# Altium schematic sheet RTD board, study for daisy chain.SchDoc
size D; PageSetup: Record=PageOptions|CenterHorizontal=True|CenterVertical=True|PrintScale=0.51|XCorrection=1.00|YCorrection=1.00|PrintKind=0|BorderSize=5000000|LeftOffset=0|BottomOffset=0|Orientation=2|PaperLength=1000|PaperWidth=1000|Scale=100|PaperSource=7|PrintQuality=-4|MediaType=1|DitherType=10|PaperKind=Tabloid|PrintScaleMode=1
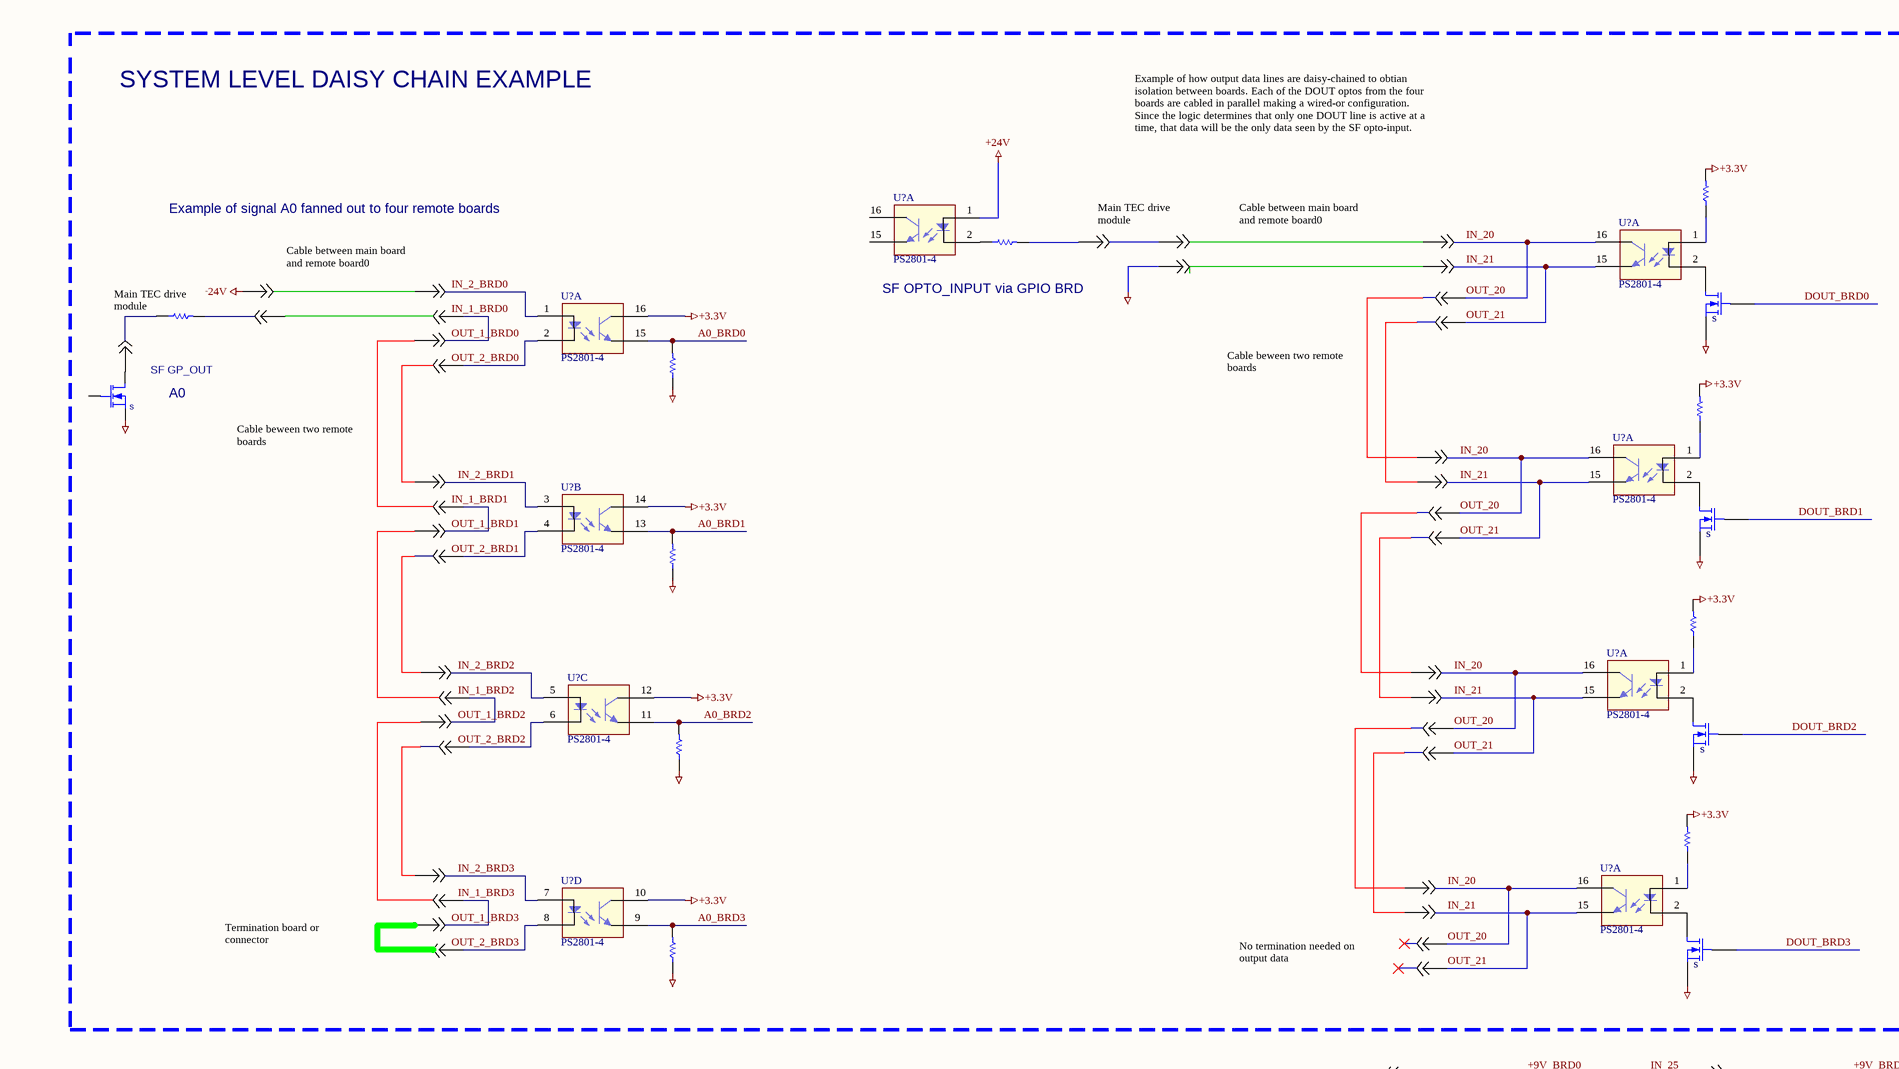
[diagram p0: RTD board, study for daisy chain.SchDoc, top left]
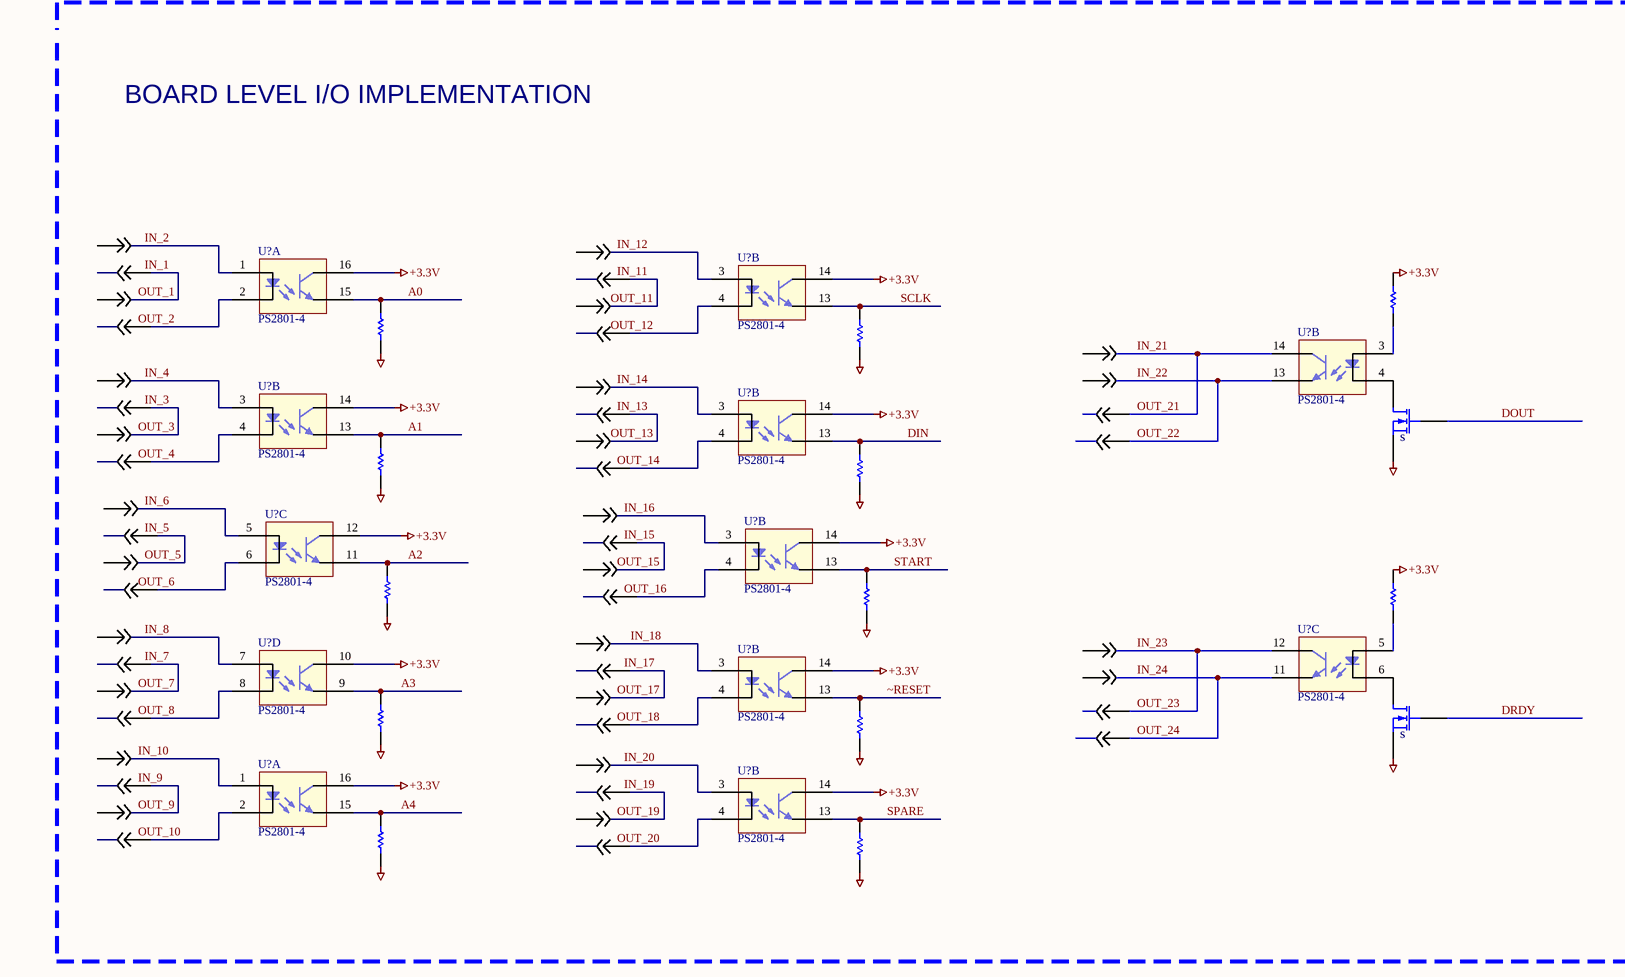
[diagram p1: RTD board, study for daisy chain.SchDoc, top right]
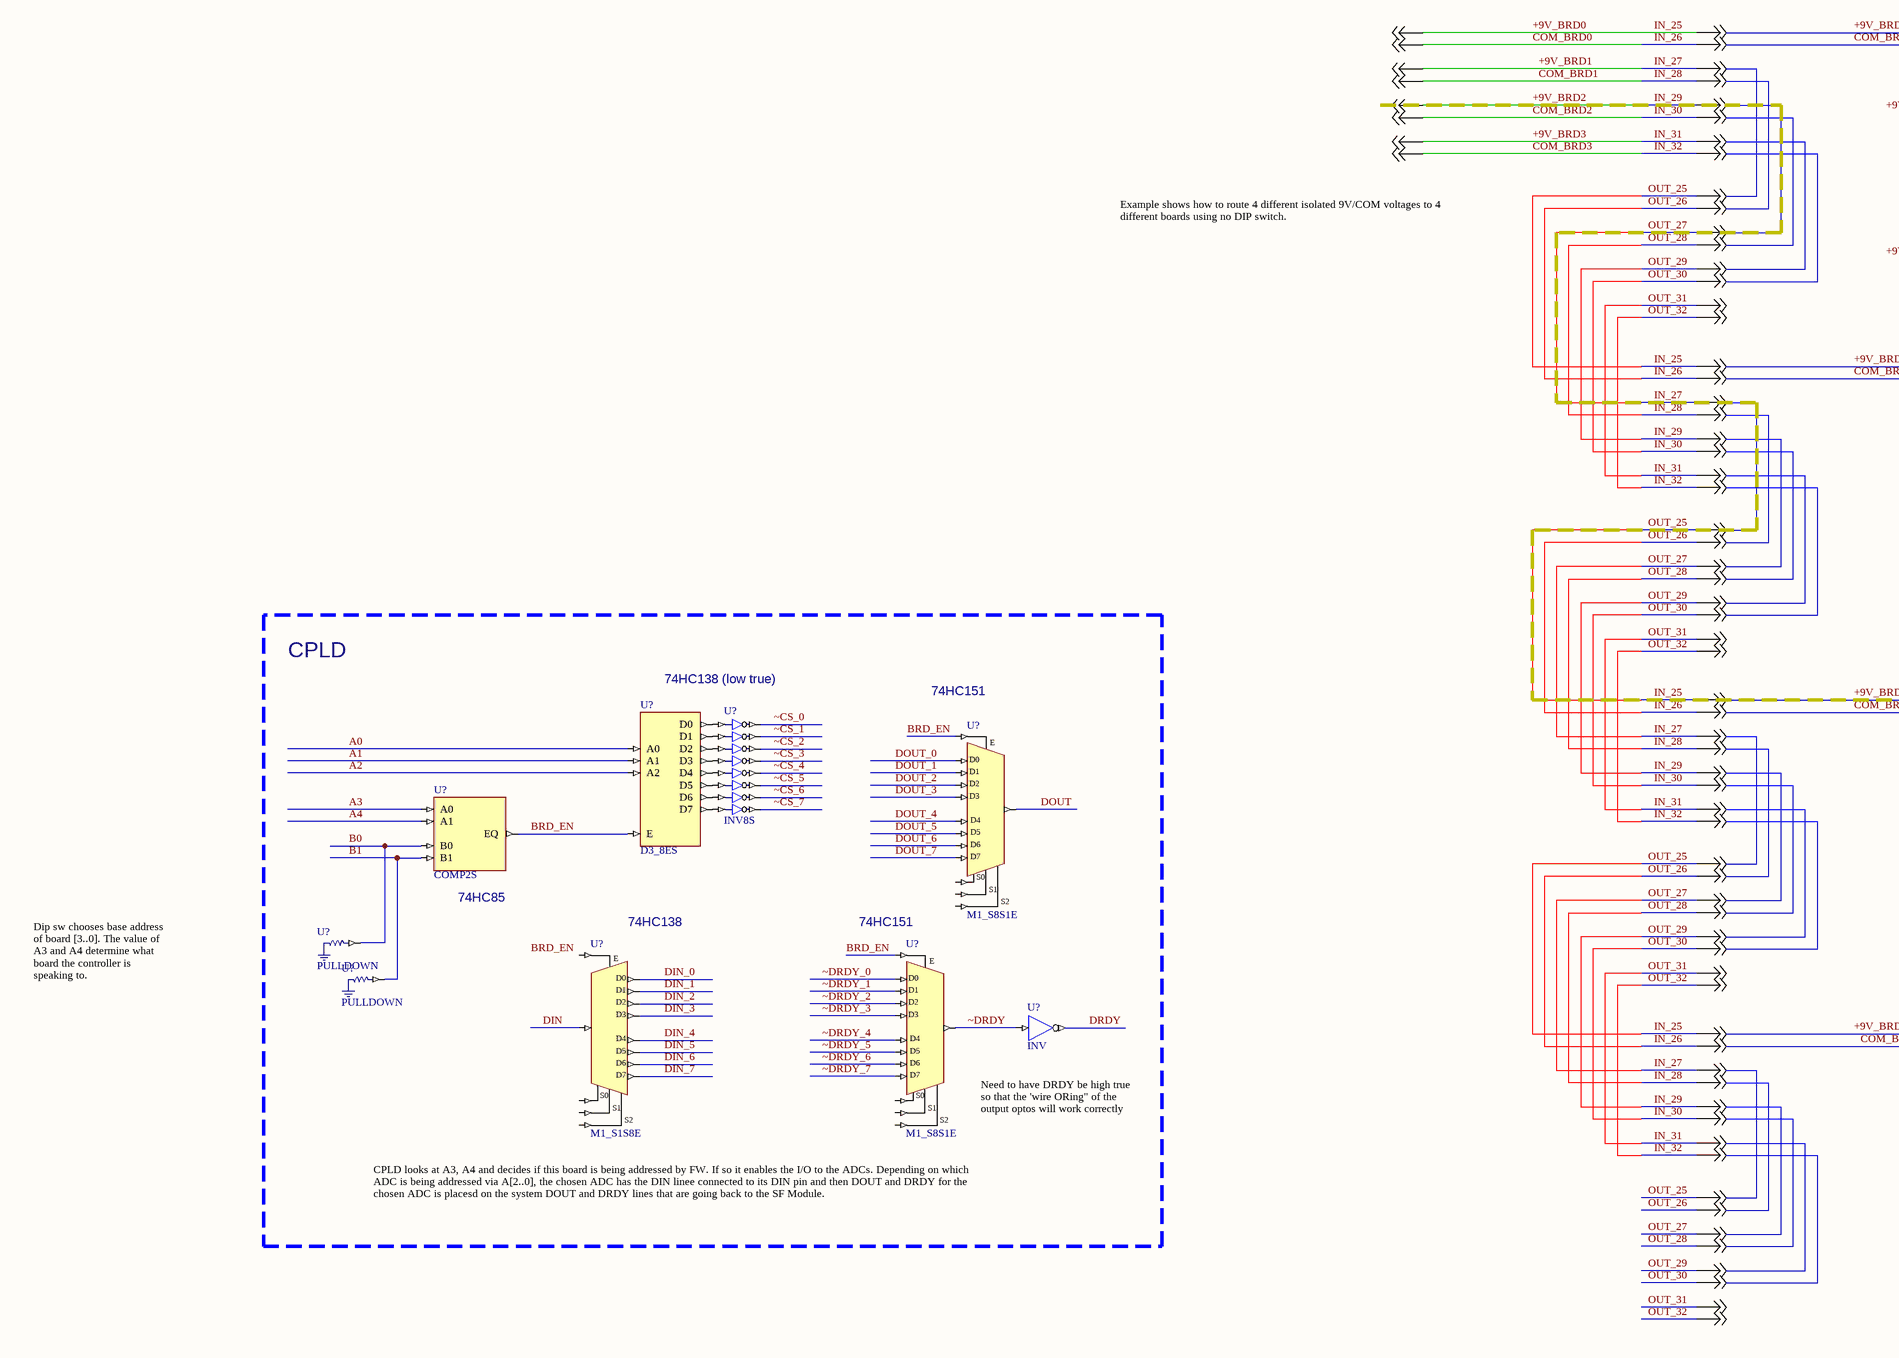
[diagram p2: RTD board, study for daisy chain.SchDoc, bottom left]
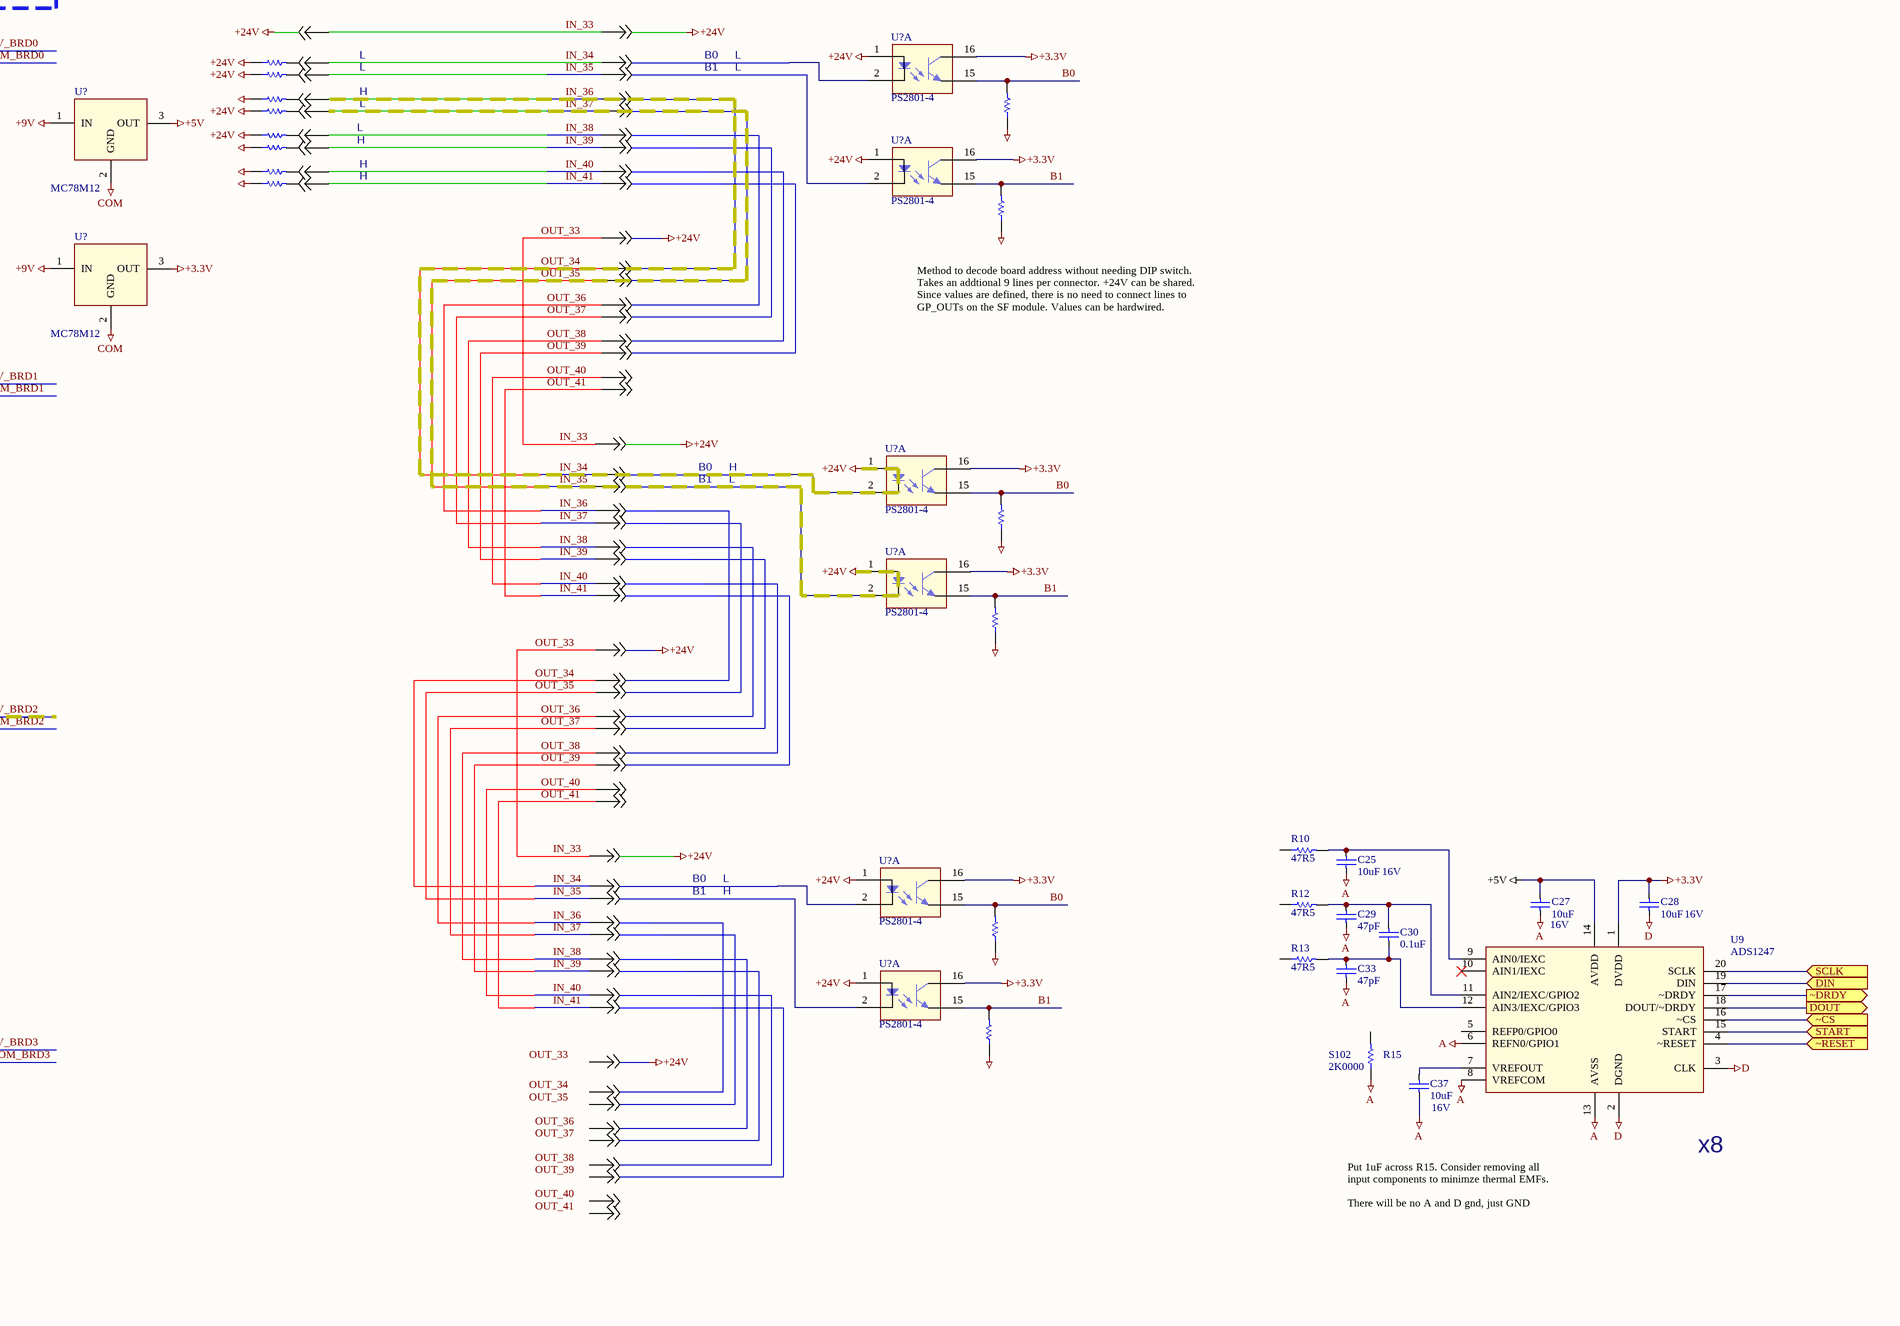
[diagram p3: RTD board, study for daisy chain.SchDoc, bottom right]

## Parts
(Parts that share a designator on the sheet are numbered #1, #2 ... from top to bottom, then left to right.)
C25  16V  value 10uF  [SMD_0805]
C27  16V  value 10uF  [SMD_0805]
C28  16V  value 10uF  [SMD_0805]
C29  value 47pF  [SMD_0805]  (hidden comment: Cap SMD)
C30  value 0.1uF  [SMD_0805]  (hidden comment: Cap SMD)
C33  value 47pF  [SMD_0805]  (hidden comment: Cap SMD)
C37  16V  value 10uF  [SMD_0805]
J?#1  Conn Feedthru  [Conn feed thru]  (value not drawn)
J?#2  Conn Feedthru  [Conn feed thru]  (value not drawn)
J?#3  Conn Feedthru  [Conn feed thru]  (value not drawn)
J?#4  Conn Feedthru  [Conn feed thru]  (value not drawn)
J?#5  Conn Feedthru  [Conn feed thru]  (value not drawn)
J?#6  Conn Feedthru  [Conn feed thru]  (value not drawn)
J?#7  Conn Feedthru  [Conn feed thru]  (value not drawn)
J?#8  Conn Feedthru  [Conn feed thru]  (value not drawn)
J?#9  Conn Feedthru  [Conn feed thru]  (value not drawn)
J?#10  Conn Feedthru  [Conn feed thru]  (value not drawn)
J?#11  Conn Feedthru  [Conn feed thru]  (value not drawn)
J?#12  Conn Feedthru  [Conn feed thru]  (value not drawn)
J?#13  Conn Feedthru  [Conn feed thru]  (value not drawn)
J?#14  Conn Feedthru  [Conn feed thru]  (value not drawn)
J?#15  Conn Feedthru  [Conn feed thru]  (value not drawn)
J?#16  Conn Feedthru  [Conn feed thru]  (value not drawn)
J?#17  Conn Feedthru  [Conn feed thru]  (value not drawn)
J?#18  Conn Feedthru  [Conn feed thru]  (value not drawn)
J?#19  Conn Feedthru  [Conn feed thru]  (value not drawn)
J?#20  Conn Feedthru  [Conn feed thru]  (value not drawn)
J?#21  Conn Feedthru  [Conn feed thru]  (value not drawn)
J?#22  Conn Feedthru  [Conn feed thru]  (value not drawn)
J?#23  Conn Feedthru  [Conn feed thru]  (value not drawn)
J?#24  Conn Feedthru  [Conn feed thru]  (value not drawn)
J?#25  Conn Feedthru  [Conn feed thru]  (value not drawn)
J?#26  Conn Feedthru  [Conn feed thru]  (value not drawn)
J?#27  Conn Feedthru  [Conn feed thru]  (value not drawn)
J?#28  Conn Feedthru  [Conn feed thru]  (value not drawn)
J?#29  Conn Feedthru  [Conn feed thru]  (value not drawn)
J?#30  Conn Feedthru  [Conn feed thru]  (value not drawn)
J?#31  Conn Feedthru  [Conn feed thru]  (value not drawn)
J?#32  Conn Feedthru  [Conn feed thru]  (value not drawn)
J?#33  Conn Feedthru  [Conn feed thru]  (value not drawn)
J?#34  Conn Feedthru  [Conn feed thru]  (value not drawn)
J?#35  Conn Feedthru  [Conn feed thru]  (value not drawn)
J?#36  Conn Feedthru  [Conn feed thru]  (value not drawn)
J?#37  Conn Feedthru  [Conn feed thru]  (value not drawn)
J?#38  Conn Feedthru  [Conn feed thru]  (value not drawn)
J?#39  Conn Feedthru  [Conn feed thru]  (value not drawn)
J?#40  Conn Feedthru  [Conn feed thru]  (value not drawn)
J?#41  Conn Feedthru  [Conn feed thru]  (value not drawn)
J?#42  Conn Feedthru  [Conn feed thru]  (value not drawn)
J?#43  Conn Feedthru  [Conn feed thru]  (value not drawn)
J?#44  Conn Feedthru  [Conn feed thru]  (value not drawn)
J?#45  Conn Feedthru  [Conn feed thru]  (value not drawn)
J?#46  Conn Feedthru  [Conn feed thru]  (value not drawn)
J?#47  Conn Feedthru  [Conn feed thru]  (value not drawn)
J?#48  Conn Feedthru  [Conn feed thru]  (value not drawn)
J?#49  Conn Feedthru  [Conn feed thru]  (value not drawn)
J?#50  Conn Feedthru  [Conn feed thru]  (value not drawn)
J?#51  Conn Feedthru  [Conn feed thru]  (value not drawn)
J?#52  Conn Feedthru  [Conn feed thru]  (value not drawn)
J?#53  Conn Feedthru  [Conn feed thru]  (value not drawn)
J?#54  Conn Feedthru  [Conn feed thru]  (value not drawn)
J?#55  Conn Feedthru  [Conn feed thru]  (value not drawn)
J?#56  Conn Feedthru  [Conn feed thru]  (value not drawn)
J?#57  Conn Feedthru  [Conn feed thru]  (value not drawn)
J?#58  Conn Feedthru  [Conn feed thru]  (value not drawn)
J?#59  Conn Feedthru  [Conn feed thru]  (value not drawn)
J?#60  Conn Feedthru  [Conn feed thru]  (value not drawn)
J?#61  Conn Feedthru  [Conn feed thru]  (value not drawn)
J?#62  Conn Feedthru  [Conn feed thru]  (value not drawn)
J?#63  Conn Feedthru  [Conn feed thru]  (value not drawn)
J?#64  Conn Feedthru  [Conn feed thru]  (value not drawn)
J?#65  Conn Feedthru  [Conn feed thru]  (value not drawn)
J?#66  Conn Feedthru  [Conn feed thru]  (value not drawn)
J?#67  Conn Feedthru  [Conn feed thru]  (value not drawn)
J?#68  Conn Feedthru  [Conn feed thru]  (value not drawn)
J?#69  Conn Feedthru  [Conn feed thru]  (value not drawn)
J?#70  Conn Feedthru  [Conn feed thru]  (value not drawn)
J?#71  Conn Feedthru  [Conn feed thru]  (value not drawn)
J?#72  Conn Feedthru  [Conn feed thru]  (value not drawn)
J?#73  Conn Feedthru  [Conn feed thru]  (value not drawn)
J?#74  Conn Feedthru  [Conn feed thru]  (value not drawn)
J?#75  Conn Feedthru  [Conn feed thru]  (value not drawn)
J?#76  Conn Feedthru  [Conn feed thru]  (value not drawn)
J?#77  Conn Feedthru  [Conn feed thru]  (value not drawn)
J?#78  Conn Feedthru  [Conn feed thru]  (value not drawn)
J?#79  Conn Feedthru  [Conn feed thru]  (value not drawn)
J?#80  Conn Feedthru  [Conn feed thru]  (value not drawn)
J?#81  Conn Feedthru  [Conn feed thru]  (value not drawn)
J?#82  Conn Feedthru  [Conn feed thru]  (value not drawn)
J?#83  Conn Feedthru  [Conn feed thru]  (value not drawn)
J?#84  Conn Feedthru  [Conn feed thru]  (value not drawn)
J?#85  Conn Feedthru  [Conn feed thru]  (value not drawn)
J?#86  Conn Feedthru  [Conn feed thru]  (value not drawn)
J?#87  Conn Feedthru  [Conn feed thru]  (value not drawn)
J?#88  Conn Feedthru  [Conn feed thru]  (value not drawn)
J?#89  Conn Feedthru  [Conn feed thru]  (value not drawn)
J?#90  Conn Feedthru  [Conn feed thru]  (value not drawn)
J?#91  Conn Feedthru  [Conn feed thru]  (value not drawn)
J?#92  Conn Feedthru  [Conn feed thru]  (value not drawn)
J?#93  Conn Feedthru  [Conn feed thru]  (value not drawn)
J?#94  Conn Feedthru  [Conn feed thru]  (value not drawn)
J?#95  Conn Feedthru  [Conn feed thru]  (value not drawn)
J?#96  Conn Feedthru  [Conn feed thru]  (value not drawn)
J?#97  Conn Feedthru  [Conn feed thru]  (value not drawn)
J?#98  Conn Feedthru  [Conn feed thru]  (value not drawn)
J?#99  Conn Feedthru  [Conn feed thru]  (value not drawn)
J?#100  Conn Feedthru  [Conn feed thru]  (value not drawn)
J?#101  Conn Feedthru  [Conn feed thru]  (value not drawn)
J?#102  Conn Feedthru  [Conn feed thru]  (value not drawn)
J?#103  Conn Feedthru  [Conn feed thru]  (value not drawn)
J?#104  Conn Feedthru  [Conn feed thru]  (value not drawn)
J?#105  Conn Feedthru  [Conn feed thru]  (value not drawn)
J?#106  Conn Feedthru  [Conn feed thru]  (value not drawn)
J?#107  Conn Feedthru  [Conn feed thru]  (value not drawn)
J?#108  Conn Feedthru  [Conn feed thru]  (value not drawn)
J?#109  Conn Feedthru  [Conn feed thru]  (value not drawn)
J?#110  Conn Feedthru  [Conn feed thru]  (value not drawn)
J?#111  Conn Feedthru  [Conn feed thru]  (value not drawn)
J?#112  Conn Feedthru  [Conn feed thru]  (value not drawn)
J?#113  Conn Feedthru  [Conn feed thru]  (value not drawn)
J?#114  Conn Feedthru  [Conn feed thru]  (value not drawn)
J?#115  Conn Feedthru  [Conn feed thru]  (value not drawn)
J?#116  Conn Feedthru  [Conn feed thru]  (value not drawn)
J?#117  Conn Feedthru  [Conn feed thru]  (value not drawn)
J?#118  Conn Feedthru  [Conn feed thru]  (value not drawn)
J?#119  Conn Feedthru  [Conn feed thru]  (value not drawn)
J?#120  Conn Feedthru  [Conn feed thru]  (value not drawn)
J?#121  Conn Feedthru  [Conn feed thru]  (value not drawn)
J?#122  Conn Feedthru  [Conn feed thru]  (value not drawn)
J?#123  Conn Feedthru  [Conn feed thru]  (value not drawn)
J?#124  Conn Feedthru  [Conn feed thru]  (value not drawn)
J?#125  Conn Feedthru  [Conn feed thru]  (value not drawn)
J?#126  Conn Feedthru  [Conn feed thru]  (value not drawn)
J?#127  Conn Feedthru  [Conn feed thru]  (value not drawn)
J?#128  Conn Feedthru  [Conn feed thru]  (value not drawn)
J?#129  Conn Feedthru  [Conn feed thru]  (value not drawn)
J?#130  Conn Feedthru  [Conn feed thru]  (value not drawn)
J?#131  Conn Feedthru  [Conn feed thru]  (value not drawn)
J?#132  Conn Feedthru  [Conn feed thru]  (value not drawn)
J?#133  Conn Feedthru  [Conn feed thru]  (value not drawn)
J?#134  Conn Feedthru  [Conn feed thru]  (value not drawn)
J?#135  Conn Feedthru  [Conn feed thru]  (value not drawn)
J?#136  Conn Feedthru  [Conn feed thru]  (value not drawn)
J?#137  Conn Feedthru  [Conn feed thru]  (value not drawn)
J?#138  Conn Feedthru  [Conn feed thru]  (value not drawn)
J?#139  Conn Feedthru  [Conn feed thru]  (value not drawn)
J?#140  Conn Feedthru  [Conn feed thru]  (value not drawn)
J?#141  Conn Feedthru  [Conn feed thru]  (value not drawn)
J?#142  Conn Feedthru  [Conn feed thru]  (value not drawn)
J?#143  Conn Feedthru  [Conn feed thru]  (value not drawn)
J?#144  Conn Feedthru  [Conn feed thru]  (value not drawn)
J?#145  Conn Feedthru  [Conn feed thru]  (value not drawn)
J?#146  Conn Feedthru  [Conn feed thru]  (value not drawn)
J?#147  Conn Feedthru  [Conn feed thru]  (value not drawn)
J?#148  Conn Feedthru  [Conn feed thru]  (value not drawn)
J?#149  Conn Feedthru  [Conn feed thru]  (value not drawn)
J?#150  Conn Feedthru  [Conn feed thru]  (value not drawn)
J?#151  Conn Feedthru  [Conn feed thru]  (value not drawn)
J?#152  Conn Feedthru  [Conn feed thru]  (value not drawn)
J?#153  Conn Feedthru  [Conn feed thru]  (value not drawn)
J?#154  Conn Feedthru  [Conn feed thru]  (value not drawn)
J?#155  Conn Feedthru  [Conn feed thru]  (value not drawn)
J?#156  Conn Feedthru  [Conn feed thru]  (value not drawn)
J?#157  Conn Feedthru  [Conn feed thru]  (value not drawn)
J?#158  Conn Feedthru  [Conn feed thru]  (value not drawn)
J?#159  Conn Feedthru  [Conn feed thru]  (value not drawn)
J?#160  Conn Feedthru  [Conn feed thru]  (value not drawn)
J?#161  Conn Feedthru  [Conn feed thru]  (value not drawn)
J?#162  Conn Feedthru  [Conn feed thru]  (value not drawn)
J?#163  Conn Feedthru  [Conn feed thru]  (value not drawn)
J?#164  Conn Feedthru  [Conn feed thru]  (value not drawn)
J?#165  Conn Feedthru  [Conn feed thru]  (value not drawn)
J?#166  Conn Feedthru  [Conn feed thru]  (value not drawn)
J?#167  Conn Feedthru  [Conn feed thru]  (value not drawn)
J?#168  Conn Feedthru  [Conn feed thru]  (value not drawn)
J?#169  Conn Feedthru  [Conn feed thru]  (value not drawn)
J?#170  Conn Feedthru  [Conn feed thru]  (value not drawn)
J?#171  Conn Feedthru  [Conn feed thru]  (value not drawn)
J?#172  Conn Feedthru  [Conn feed thru]  (value not drawn)
J?#173  Conn Feedthru  [Conn feed thru]  (value not drawn)
J?#174  Conn Feedthru  [Conn feed thru]  (value not drawn)
J?#175  Conn Feedthru  [Conn feed thru]  (value not drawn)
J?#176  Conn Feedthru  [Conn feed thru]  (value not drawn)
J?#177  Conn Feedthru  [Conn feed thru]  (value not drawn)
J?#178  Conn Feedthru  [Conn feed thru]  (value not drawn)
J?#179  Conn Feedthru  [Conn feed thru]  (value not drawn)
J?#180  Conn Feedthru  [Conn feed thru]  (value not drawn)
J?#181  Conn Feedthru  [Conn feed thru]  (value not drawn)
J?#182  Conn Feedthru  [Conn feed thru]  (value not drawn)
J?#183  Conn Feedthru  [Conn feed thru]  (value not drawn)
J?#184  Conn Feedthru  [Conn feed thru]  (value not drawn)
J?#185  Conn Feedthru  [Conn feed thru]  (value not drawn)
J?#186  Conn Feedthru  [Conn feed thru]  (value not drawn)
J?#187  Conn Feedthru  [Conn feed thru]  (value not drawn)
J?#188  Conn Feedthru  [Conn feed thru]  (value not drawn)
J?#189  Conn Feedthru  [Conn feed thru]  (value not drawn)
J?#190  Conn Feedthru  [Conn feed thru]  (value not drawn)
J?#191  Conn Feedthru  [Conn feed thru]  (value not drawn)
J?#192  Conn Feedthru  [Conn feed thru]  (value not drawn)
J?#193  Conn Feedthru  [Conn feed thru]  (value not drawn)
J?#194  Conn Feedthru  [Conn feed thru]  (value not drawn)
J?#195  Conn Feedthru  [Conn feed thru]  (value not drawn)
J?#196  Conn Feedthru  [Conn feed thru]  (value not drawn)
J?#197  Conn Feedthru  [Conn feed thru]  (value not drawn)
J?#198  Conn Feedthru  [Conn feed thru]  (value not drawn)
J?#199  Conn Feedthru  [Conn feed thru]  (value not drawn)
J?#200  Conn Feedthru  [Conn feed thru]  (value not drawn)
J?#201  Conn Feedthru  [Conn feed thru]  (value not drawn)
J?#202  Conn Feedthru  [Conn feed thru]  (value not drawn)
J?#203  Conn Feedthru  [Conn feed thru]  (value not drawn)
J?#204  Conn Feedthru  [Conn feed thru]  (value not drawn)
J?#205  Conn Feedthru  [Conn feed thru]  (value not drawn)
J?#206  Conn Feedthru  [Conn feed thru]  (value not drawn)
J?#207  Conn Feedthru  [Conn feed thru]  (value not drawn)
J?#208  Conn Feedthru  [Conn feed thru]  (value not drawn)
J?#209  Conn Feedthru  [Conn feed thru]  (value not drawn)
J?#210  Conn Feedthru  [Conn feed thru]  (value not drawn)
J?#211  Conn Feedthru  [Conn feed thru]  (value not drawn)
J?#212  Conn Feedthru  [Conn feed thru]  (value not drawn)
J?#213  Conn Feedthru  [Conn feed thru]  (value not drawn)
J?#214  Conn Feedthru  [Conn feed thru]  (value not drawn)
J?#215  Conn Feedthru  [Conn feed thru]  (value not drawn)
J?#216  Conn Feedthru  [Conn feed thru]  (value not drawn)
J?#217  Conn Feedthru  [Conn feed thru]  (value not drawn)
J?#218  Conn Feedthru  [Conn feed thru]  (value not drawn)
J?#219  Conn Feedthru  [Conn feed thru]  (value not drawn)
J?#220  Conn Feedthru  [Conn feed thru]  (value not drawn)
J?#221  Conn Feedthru  [Conn feed thru]  (value not drawn)
Q?#1  MOSFET-N SOT23  [SMD_SOT23_3]  (value not drawn)
Q?#2  STD30NF03L  [TO-252(D-PAK)  PowerPAD]  (value not drawn)
Q?#3  MOSFET-N SOT23  [SMD_SOT23_3]  (value not drawn)
Q?#4  MOSFET-N SOT23  [SMD_SOT23_3]  (value not drawn)
Q?#5  MOSFET-N SOT23  [SMD_SOT23_3]  (value not drawn)
Q?#6  MOSFET-N SOT23  [SMD_SOT23_3]  (value not drawn)
Q?#7  MOSFET-N SOT23  [SMD_SOT23_3]  (value not drawn)
R10  value 47R5  [SMD_0805]  (hidden comment: Res 0805)
R12  value 47R5  [SMD_0805]  (hidden comment: Res 0805)
R13  value 47R5  [SMD_0805]  (hidden comment: Res 0805)
R15  S102  value 2K0000  [Vishay S102 series]
R?#1  Res 0805  [smd_0805]  (value not drawn)
R?#2  Res 0805  [smd_0805]  (value not drawn)
R?#3  Res 0805  [smd_0805]  (value not drawn)
R?#4  Res 0805  [smd_0805]  (value not drawn)
R?#5  Res 0805  [smd_0805]  (value not drawn)
R?#6  Res 0805  [smd_0805]  (value not drawn)
R?#7  Res 0805  [smd_0805]  (value not drawn)
R?#8  Res 0805  [smd_0805]  (value not drawn)
R?#9  Res 0805  [smd_0805]  (value not drawn)
R?#10  Res 0805  [smd_0805]  (value not drawn)
R?#11  Res 0805  [smd_0805]  (value not drawn)
R?#12  Res 0805  [smd_0805]  (value not drawn)
R?#13  Res 0805  [smd_0805]  (value not drawn)
R?#14  Res 0805  [smd_0805]  (value not drawn)
R?#15  Res 0805  [smd_0805]  (value not drawn)
R?#16  Res 0805  [smd_0805]  (value not drawn)
R?#17  Res 0805  [smd_0805]  (value not drawn)
R?#18  Res 0805  [smd_0805]  (value not drawn)
R?#19  Res 0805  [smd_0805]  (value not drawn)
R?#20  Res 0805  [smd_0805]  (value not drawn)
R?#21  Res 0805  [smd_0805]  (value not drawn)
R?#22  Res 0805  [smd_0805]  (value not drawn)
R?#23  Res 0805  [smd_0805]  (value not drawn)
R?#24  Res 0805  [smd_0805]  (value not drawn)
R?#25  Res 0805  [smd_0805]  (value not drawn)
R?#26  Res 0805  [smd_0805]  (value not drawn)
R?#27  Res 0805  [smd_0805]  (value not drawn)
R?#28  Res 0805  [smd_0805]  (value not drawn)
R?#29  Res 0805  [smd_0805]  (value not drawn)
R?#30  Res 0805  [smd_0805]  (value not drawn)
R?#31  Res 0805  [smd_0805]  (value not drawn)
R?#32  Res 0805  [smd_0805]  (value not drawn)
R?#33  Res 0805  [smd_0805]  (value not drawn)
R?#34  Res 0805  [smd_0805]  (value not drawn)
R?#35  Res 0805  [smd_0805]  (value not drawn)
R?#36  Res 0805  [smd_0805]  (value not drawn)
U9  ADS1247  [TSSOP20]
U?#1  PS2801-4  [SO-16]  (part A of 4)
U?#2  PS2801-4  [SO-16]  (part A of 4)
U?#3  PS2801-4  [SO-16]  (part A of 4)
U?#4  PS2801-4  [SO-16]  (part A of 4)
U?#5  PS2801-4  [SO-16]  (part B of 4)
U?#6  PS2801-4  [SO-16]  (part B of 4)
U?#7  PS2801-4  [SO-16]  (part A of 4)
U?#8  PS2801-4  [SO-16]  (part B of 4)
U?#9  PS2801-4  [SO-16]  (part B of 4)
U?#10  PS2801-4  [SO-16]  (part B of 4)
U?#11  PS2801-4  [SO-16]  (part C of 4)
U?#12  PS2801-4  [SO-16]  (part B of 4)
U?#13  PS2801-4  [SO-16]  (part A of 4)
U?#14  PS2801-4  [SO-16]  (part C of 4)
U?#15  PS2801-4  [SO-16]  (part C of 4)
U?#16  PS2801-4  [SO-16]  (part D of 4)
U?#17  PS2801-4  [SO-16]  (part B of 4)
U?#18  PS2801-4  [SO-16]  (part A of 4)
U?#19  PS2801-4  [SO-16]  (part B of 4)
U?#20  PS2801-4  [SO-16]  (part A of 4)
U?#21  PS2801-4  [SO-16]  (part D of 4)
U?#22  PS2801-4  [SO-16]  (part A of 4)
U?#23  value MC78M12  [TO-252(D-PAK)  PowerPAD]  (hidden comment: Voltage Reg, Pos Fixed)
U?#24  PS2801-4  [SO-16]  (part A of 4)
U?#25  value MC78M12  [TO-252(D-PAK)  PowerPAD]  (hidden comment: Voltage Reg, Pos Fixed)
U?#26  PS2801-4  [SO-16]  (part A of 4)
U?#27  PS2801-4  [SO-16]  (part A of 4)
U?#28  D3_8ES
U?#29  INV8S
U?#30  M1_S8S1E
U?#31  COMP2S
U?#32  PS2801-4  [SO-16]  (part A of 4)
U?#33  PULLDOWN
U?#34  PULLDOWN
U?#35  M1_S1S8E
U?#36  M1_S8S1E
U?#37  PS2801-4  [SO-16]  (part A of 4)
U?#38  INV

## Blocks framed on the sheet
CPLD: U?#28-U?#31 U?#33-U?#36 U?#38

## Ports
DIN (in), DOUT (out), SCLK (in), START (in), ~CS (in), ~DRDY (out), ~RESET (in)

## Nets
+3.3V: C28.2 R?#1.2 R?#5.2 R?#6.2 R?#12.2 R?#15.2 R?#19.2 U9.1(DVDD) U?#3.16(Collector) U?#4.16(Collector) U?#5.14(Collector) U?#8.14(Collector) U?#9.14(Collector) U?#10.14(Collector) U?#11.12(Collector) U?#12.14(Collector) U?#14.12(Collector) U?#16.10(Collector) U?#17.14(Collector) U?#18.16(Collector) U?#19.14(Collector) U?#21.10(Collector) U?#22.16(Collector) U?#24.16(Collector) U?#25.3(OUT) U?#26.16(Collector) U?#27.16(Collector) U?#32.16(Collector) U?#37.16(Collector)
+5V: C27.2 U9.14(AVDD) U?#23.3(OUT)
+9V: U?#23.1(IN) U?#25.1(IN)
+24V: J?#6.1 R?#23.1 R?#24.1 R?#26.1 R?#28.1 U?#1.1(Anode) U?#22.1(Anode) U?#24.1(Anode) U?#26.1(Anode) U?#27.1(Anode) U?#32.1(Anode) U?#37.1(Anode)
A: C25.1 C27.1 C29.1 C33.1 C37.1 R15.1 U9.6(REFN0/GPIO1) U9.8(VREFCOM) U9.13(AVSS)
COM: U?#23.2(GND) U?#25.2(GND)
D: C28.1 U9.2(DGND) U9.3(CLK)
NetJ?#4_1: J?#4.1 Q?#1.2(S) Q?#2.3(S) Q?#3.2(S) Q?#4.2(S) Q?#5.2(S) Q?#6.2(S) Q?#7.2(S) R?#4.1 R?#7.1 R?#8.1 R?#9.1 R?#10.1 R?#11.1 R?#13.1 R?#14.1 R?#16.1 R?#17.1 R?#18.1 R?#20.1 R?#21.1 R?#22.1 R?#25.1 R?#27.1 R?#29.1 R?#30.1 R?#31.1 R?#32.1 R?#33.1 R?#34.1 R?#35.1 R?#36.1
+9V_BRD0: J?#89.1 J?#90.1 J?#121.1 J?#137.1 J?#151.1 J?#166.1 J?#181.1 J?#197.1 J?#213.1  [also labelled IN_25, OUT_25]
+9V_BRD1: J?#97.1 J?#98.1 J?#124.1 J?#140.1 J?#155.1 J?#170.1 J?#185.1 J?#200.1 J?#216.1  [also labelled IN_27, OUT_27]
+9V_BRD2: J?#105.1 J?#106.1 J?#128.1 J?#143.1 J?#159.1 J?#174.1 J?#189.1 J?#204.1 J?#218.1  [also labelled IN_29, OUT_29]
+9V_BRD3: J?#113.1 J?#114.1 J?#132.1 J?#147.1 J?#162.1 J?#178.1 J?#193.1 J?#208.1 J?#220.1  [also labelled IN_31, OUT_31]
A0: R?#7.2 U?#4.15(Emitter) U?#28.A0
A0_BRD0: R?#4.2 U?#3.15(Emitter)
A0_BRD1: R?#10.2 U?#9.13(Emitter)
A0_BRD2: R?#16.2 U?#14.11(Emitter)
A0_BRD3: R?#22.2 U?#21.9(Emitter)
A1: R?#9.2 U?#8.13(Emitter) U?#28.A1
A2: R?#13.2 U?#11.11(Emitter) U?#28.A2
A3: R?#17.2 U?#16.9(Emitter) U?#31.A0
A4: R?#20.2 U?#18.15(Emitter) U?#31.A1
B0: R?#27.2 R?#33.2 R?#35.2 U?#22.15(Emitter) U?#26.15(Emitter) U?#31.B0 U?#32.15(Emitter) U?#33.O
B1: R?#32.2 R?#34.2 R?#36.2 U?#24.15(Emitter) U?#27.15(Emitter) U?#31.B1 U?#34.O U?#37.15(Emitter)
BRD_EN: U?#28.E U?#30.E U?#31.EQ U?#36.E
COM_BRD0: J?#91.1 J?#92.1 J?#122.1 J?#139.1 J?#153.1 J?#168.1 J?#183.1 J?#198.1 J?#215.1  [also labelled IN_26, OUT_26]
COM_BRD1: J?#99.1 J?#100.1 J?#125.1 J?#141.1 J?#157.1 J?#172.1 J?#187.1 J?#202.1 J?#217.1  [also labelled IN_28, OUT_28]
COM_BRD2: J?#107.1 J?#108.1 J?#129.1 J?#144.1 J?#160.1 J?#176.1 J?#191.1 J?#206.1 J?#219.1  [also labelled IN_30, OUT_30]
COM_BRD3: J?#115.1 J?#116.1 J?#133.1 J?#148.1 J?#163.1 J?#179.1 J?#195.1 J?#210.1 J?#221.1  [also labelled IN_32, OUT_32]
DIN: R?#11.2 U?#10.13(Emitter) U?#35.O
DIN: U9.19(DIN) ; port DIN  [a separate net that carries the same name]
DIN_0: U?#35.D0
DIN_1: U?#35.D1
DIN_2: U?#35.D2
DIN_3: U?#35.D3
DIN_4: U?#35.D4
DIN_5: U?#35.D5
DIN_6: U?#35.D6
DIN_7: U?#35.D7
DOUT: Q?#3.1(G) U?#30.O
DOUT: U9.18(DOUT/~DRDY) ; port DOUT  [a separate net that carries the same name]
DOUT_0: U?#30.D0
DOUT_1: U?#30.D1
DOUT_2: U?#30.D2
DOUT_3: U?#30.D3
DOUT_4: U?#30.D4
DOUT_5: U?#30.D5
DOUT_6: U?#30.D6
DOUT_7: U?#30.D7
DOUT_BRD0: Q?#1.1(G)
DOUT_BRD1: Q?#4.1(G)
DOUT_BRD2: Q?#5.1(G)
DOUT_BRD3: Q?#7.1(G)
DRDY: Q?#6.1(G) U?#38.O
IN_2: U?#4.1(Anode)
IN_2_BRD0: U?#3.1(Anode)
IN_2_BRD1: U?#9.3(Anode)
IN_2_BRD2: U?#14.5(Anode)
IN_2_BRD3: U?#21.7(Anode)
IN_4: U?#8.3(Anode)
IN_6: U?#11.5(Anode)
IN_8: U?#16.7(Anode)
IN_10: U?#18.1(Anode)
IN_12: U?#5.3(Anode)
IN_14: U?#10.3(Anode)
IN_16: U?#12.3(Anode)
IN_18: U?#17.3(Anode)
IN_20: J?#8.1 J?#34.1 J?#59.1 J?#84.1 U?#2.16(Collector) U?#7.16(Collector) U?#13.16(Collector) U?#19.3(Anode) U?#20.16(Collector)  [also labelled OUT_20]
IN_21: J?#11.1 J?#33.1 J?#39.1 J?#64.1 J?#86.1 U?#2.15(Emitter) U?#6.14(Collector) U?#7.15(Emitter) U?#13.15(Emitter) U?#20.15(Emitter)  [also labelled OUT_21]
IN_22: J?#38.1 U?#6.13(Emitter)  [also labelled OUT_22]
IN_23: J?#67.1 U?#15.12(Collector)  [also labelled OUT_23]
IN_24: J?#70.1 U?#15.11(Emitter)  [also labelled OUT_24]
IN_33: J?#87.1 J?#88.1 J?#123.1 J?#142.1 J?#161.1 J?#180.1  [also labelled OUT_33]
IN_34: J?#93.1 J?#94.1 J?#126.1 J?#145.1 J?#164.1 J?#182.1  [also labelled OUT_34]
IN_35: J?#95.1 J?#96.1 J?#127.1 J?#146.1 J?#165.1 J?#184.1  [also labelled OUT_35]
IN_36: J?#101.1 J?#102.1 J?#130.1 J?#149.1 J?#167.1 J?#186.1  [also labelled OUT_36]
IN_37: J?#103.1 J?#104.1 J?#131.1 J?#150.1 J?#169.1 J?#188.1  [also labelled OUT_37]
IN_38: J?#109.1 J?#110.1 J?#134.1 J?#152.1 J?#171.1 J?#190.1  [also labelled OUT_38]
IN_39: J?#111.1 J?#112.1 J?#135.1 J?#154.1 J?#173.1 J?#192.1  [also labelled OUT_39]
IN_40: J?#117.1 J?#118.1 J?#136.1 J?#156.1 J?#175.1 J?#194.1  [also labelled OUT_40]
IN_41: J?#119.1 J?#120.1 J?#138.1 J?#158.1 J?#177.1 J?#196.1  [also labelled OUT_41]
OUT_1: J?#17.1
OUT_1_BRD0: J?#10.1
OUT_1_BRD1: J?#31.1
OUT_1_BRD2: J?#53.1
OUT_1_BRD3: J?#80.1
OUT_3: J?#30.1
OUT_5: J?#45.1
OUT_7: J?#60.1
OUT_9: J?#73.1
OUT_11: J?#18.1
OUT_13: J?#32.1
OUT_15: J?#46.1
OUT_17: J?#61.1
OUT_19: J?#74.1
SCLK: R?#8.2 U?#5.13(Emitter)
SCLK: U9.20(SCLK) ; port SCLK  [a separate net that carries the same name]
SPARE: R?#21.2 U?#19.13(Emitter)
START: R?#14.2 U?#12.13(Emitter)
START: U9.15(START) ; port START  [a separate net that carries the same name]
~CS: U9.16(~CS) ; port ~CS
~CS_0: U?#29.O0
~CS_1: U?#29.O1
~CS_2: U?#29.O2
~CS_3: U?#29.O3
~CS_4: U?#29.O4
~CS_5: U?#29.O5
~CS_6: U?#29.O6
~CS_7: U?#29.O7
~DRDY: U?#36.O U?#38.I
~DRDY: U9.17(~DRDY) ; port ~DRDY  [a separate net that carries the same name]
~DRDY_0: U?#36.D0
~DRDY_1: U?#36.D1
~DRDY_2: U?#36.D2
~DRDY_3: U?#36.D3
~DRDY_4: U?#36.D4
~DRDY_5: U?#36.D5
~DRDY_6: U?#36.D6
~DRDY_7: U?#36.D7
~RESET: R?#18.2 U?#17.13(Emitter)
~RESET: U9.4(~RESET) ; port ~RESET  [a separate net that carries the same name]
NetC25_2: C25.2 R10.2 U9.9(AIN0/IEXC)
NetC29_2: C29.2 C30.2 R12.2 U9.11(AIN2/IEXC/GPIO2)
NetC30_1: C30.1 C33.2 R13.2 U9.12(AIN3/IEXC/GPIO3)
NetC37_2: C37.2 U9.7(VREFOUT)
NetJ?#1_1: J?#1.1 R?#2.2
NetJ?#13_1: J?#13.1 Q?#2.2(D)
NetJ?#16_1: J?#16.1 U?#3.2(Cathode)
NetJ?#21_1: J?#21.1 U?#4.2(Cathode)
NetJ?#22_1: J?#22.1 U?#5.4(Cathode)
NetJ?#40_1: J?#40.1 U?#8.4(Cathode)
NetJ?#41_1: J?#41.1 U?#9.4(Cathode)
NetJ?#42_1: J?#42.1 U?#10.4(Cathode)
NetJ?#49_1: J?#49.1 U?#11.6(Cathode)
NetJ?#52_1: J?#52.1 U?#12.4(Cathode)
NetJ?#62_1: J?#62.1 U?#14.6(Cathode)
NetJ?#68_1: J?#68.1 U?#16.8(Cathode)
NetJ?#69_1: J?#69.1 U?#17.4(Cathode)
NetJ?#79_1: J?#79.1 U?#18.2(Cathode)
NetJ?#81_1: J?#81.1 U?#19.4(Cathode)
NetJ?#85_1: J?#85.1 U?#21.8(Cathode)
NetQ?#1_3: Q?#1.3(D) U?#2.2(Cathode)
NetQ?#3_3: Q?#3.3(D) U?#6.4(Cathode)
NetQ?#4_3: Q?#4.3(D) U?#7.2(Cathode)
NetQ?#5_3: Q?#5.3(D) U?#13.2(Cathode)
NetQ?#6_3: Q?#6.3(D) U?#15.6(Cathode)
NetQ?#7_3: Q?#7.3(D) U?#20.2(Cathode)
NetR?#1_1: R?#1.1 U?#2.1(Anode)
NetR?#2_1: R?#2.1 U?#1.2(Cathode)
NetR?#5_1: R?#5.1 U?#6.3(Anode)
NetR?#6_1: R?#6.1 U?#7.1(Anode)
NetR?#12_1: R?#12.1 U?#13.1(Anode)
NetR?#15_1: R?#15.1 U?#15.5(Anode)
NetR?#19_1: R?#19.1 U?#20.1(Anode)
NetU?#28_D0: U?#28.D0 U?#29.I0
NetU?#28_D1: U?#28.D1 U?#29.I1
NetU?#28_D2: U?#28.D2 U?#29.I2
NetU?#28_D3: U?#28.D3 U?#29.I3
NetU?#28_D4: U?#28.D4 U?#29.I4
NetU?#28_D5: U?#28.D5 U?#29.I5
NetU?#28_D6: U?#28.D6 U?#29.I6
NetU?#28_D7: U?#28.D7 U?#29.I7

Not connected (* = marked no-connect by the designer): J?#2 1; J?#3 1; J?#5 1; J?#7 1; J?#9 1; J?#12 1; J?#14 1; J?#15 1; J?#19 1; J?#20 1; J?#23 1; J?#24 1; J?#25 1; J?#26 1; J?#27 1; J?#28 1; J?#29 1; J?#35 1; J?#36 1; J?#37 1; J?#43 1; J?#44 1; J?#47 1; J?#48 1; J?#50 1; J?#51 1; J?#54 1; J?#55 1; J?#56 1; J?#57 1; J?#58 1; J?#63 1; J?#65 1; J?#66 1; J?#71 1; J?#72 1; J?#75 1; J?#76 1; J?#77 1; J?#78 1; J?#82 1; J?#83 1; J?#199 1; J?#201 1; J?#203 1; J?#205 1; J?#207 1; J?#209 1; J?#211 1; J?#212 1; J?#214 1; Q?#2 1(G); R10 1; R12 1; R13 1; R15 2; R?#3 1 2; R?#23 2; R?#24 2; R?#25 2; R?#26 2; R?#28 2; R?#29 2; R?#30 2; R?#31 2; U9 5(REFP0/GPIO0) 10(AIN1/IEXC)*; U?#1 15(Emitter) 16(Collector); U?#22 2(Cathode); U?#24 2(Cathode); U?#26 2(Cathode); U?#27 2(Cathode); U?#30 S0 S1 S2; U?#32 2(Cathode); U?#35 E S0 S1 S2; U?#36 S0 S1 S2; U?#37 2(Cathode)

## Notes on the sheet
- SYSTEM LEVEL DAISY CHAIN EXAMPLE
- Example of how output data lines are daisy-chained to obtian isolation between boards. Each of the DOUT optos from the four boards are cabled in parallel making a wired-or configuration. Since the logic determines that only one DOUT line is active at a time, that data will be the only data seen by the SF opto-input.
- Example of signal A0 fanned out to four remote boards
- (near J?#2) Main TEC drive module
- (near J?#6) Cable between main board and remote board0
- Cable between main board and remote board0
- BOARD LEVEL I/O IMPLEMENTATION
- (near R?#3) Main TEC drive module
- SF OPTO_INPUT via GPIO BRD
- SF GP_OUT
- A0
- Cable beween two remote boards
- Termination board or connector
- No termination needed on output data
- L
- B0
- H
- B1
- (near J?#115) Example shows how to route 4 different isolated 9V/COM voltages to 4 different boards using no DIP switch.
- (near R?#32) Method to decode board address without needing DIP switch. Takes an addtional 9 lines per connector. +24V can be shared. Since values are defined, there is no need to connect lines to GP_OUTs on the SF module. Values can be hardwired.
- (near U?#28) 74HC138 (low true)
- (near U?#30) 74HC151
- (near U?#31) 74HC85
- (near U?#35) 74HC138
- (near U?#36) 74HC151
- Dip sw chooses base address of board [3..0]. The value of A3 and A4 determine what board the controller is speaking to.
- (near U?#36) Need to have DRDY be high true so that the 'wire ORing" of the output optos will work correctly
- (near U9) x8
- (near U?#36) CPLD looks at A3, A4 and decides if this board is being addressed by FW. If so it enables the I/O to the ADCs. Depending on which ADC is being addressed via A[2..0], the chosen ADC has the DIN linee connected to its DIN pin and then DOUT and DRDY for the chosen ADC is placesd on the system DOUT and DRDY lines that are going back to the SF Module.
- Put 1uF across R15. Consider removing all input components to minimze thermal EMFs.
  There will be no A and D gnd, just GND
- Labels drawn without touching a wire or pin: BRD_EN, IN_1, IN_1_BRD0, IN_1_BRD1, IN_1_BRD2, IN_1_BRD3, IN_3, IN_5, IN_7, IN_9, IN_11, IN_13, IN_15, IN_17, IN_19, OUT_2, OUT_2_BRD0, OUT_2_BRD1, OUT_2_BRD2, OUT_2_BRD3, OUT_4, OUT_6, OUT_8, OUT_10, OUT_12, OUT_14, OUT_16, OUT_18, OUT_20, OUT_33, OUT_34, OUT_35, OUT_36, OUT_37, OUT_38, OUT_39, OUT_40, OUT_41
- (in symbol MOSFET-N SOT23) s
- (in symbol STD30NF03L) s

## Library data of the parts
C25 C27 C28 C37 = Cap SMD: Capacitor; LCO p/n: 120-00007
C29 C33 = Cap SMD: Capacitor; LCO p/n: 120-00056
C30 = Cap SMD: Capacitor; LCO p/n: 120-00002
J?#1-J?#221 = Conn Feedthru: Small feedthru; VALUE: Conn Feedthru
Q?#1 Q?#3-Q?#7 = MOSFET-N SOT23: N Chan MOSFET LOGIC LEVEL; Manuf p/n: ZXMN3B01FTA; Vendor Mult.: 1; LCO p/n: 195-00002; COST: 0.46
Q?#2 = STD30NF03L: N-Chan MOSFET; Manufacturer: ST MICRO; LCO p/n: XXXXXXXXXX; Vendor: Digi-Key; Vendor Mult.: 1; VALUE: STD30NF03L
R10 R12 R13 = Res SMD: Resistor 0805; Manufacturer: Vishay/Dale; Manuf p/n: CRCW080547R5FKEA; Vendor: DIGIKEY; Vendor p/n: 541-47R5CCT-ND; Vendor Mult.: 10; LCO p/n: 181-047R5; COST: 0.09
R15 = RES TH Radial: Vishay Foil Resistor; LCO p/n: 180-00011
R?#1-R?#36 = Res SMD: Resistor 0805; Manufacturer: Vishay/Dale; Manuf p/n: CRCW080500R0FKEA; Vendor: DIGIKEY; Vendor p/n: 541-00R0CCT-ND; Vendor Mult.: 10; VALUE: 00R0; COST: 0.09
U9 = ADS1247: 24bit ADC for Temp Sensors; Manufacturer: TI; Manuf p/n: ADS1247IPW; LCO p/n: 150-00106; Vendor: DK; Vendor p/n: 296-24293-5-ND
U?#1-U?#22 U?#24 U?#26 U?#27 U?#32 U?#37 = Opto Coupler Quad 40V: Quad Opto Coupler Open Collector; Manufacturer: NEC; Manuf p/n: PS2801C-4-F3-A; VALUE: PS2301; Vendor: digikey; Vendor Mult.: 1; Vendor p/n: PS2801C-4-F3-ACT-ND; LCO p/n: 150-00012; COST: 2.04
U?#23 U?#25 = Voltage Reg, Pos Fixed: MC78M12; Manufacturer: On Semi; Manuf p/n: MC78M12CDTRKG; LCO p/n: 150-00081; Vendor: Digi-Key; Vendor Mult.: 1; Vendor p/n: MC78M12CDTRKGOSCT-ND; COST: 0.61
U?#28 = D3_8ES: Binary 3- to 8-Bit Decoder with Enable, Single Pin Version; XilinxEquivalent: D3_8E; SubClass: n_m; Enable: High; PortSize: 8; ArchiveName: GENERIC; VHDLIB_SIM: GENERIC_LIB; Published: 29-Jan-2004; Publisher: Altium Limited; LastRevisionNo: 1.00.00; HelpURL: CR0118 FPGA Generic Library Guide.pdf#page=159; ComponentLink1URL: CR0131 FPGA Decoder Resource Usage.pdf#page=8; ComponentLink1Description: Core &Resource Usage; FunctionalClass: Decoder; PortStyle: Single Pin Version
U?#29 = INV8S: 8-Bit Inverter, Single Pin Version; FunctionalClass: Logic Primitive; SubClass: INV; PortSize: 8; ArchiveName: GENERIC; VHDLIB_SIM: GENERIC_LIB; Published: 29-Jan-2004; Publisher: Altium Limited; LastRevisionNo: 1.00.00; HelpURL: CR0118 FPGA Generic Library Guide.pdf#page=291; ComponentLink1URL: CR0136 FPGA Logic Primitive Resource Usage.pdf#page=75; ComponentLink1Description: Core &Resource Usage; PortStyle: Single Pin Version
U?#30 U?#36 = M1_S8S1E: 8x1-Single Wire to 1x1-Single Wire Multiplexer With Enable; XilinxEquivalent: M8_1E; SubClass: SnS1; Enable: High; PortSize: 1; PortStyle: Single Pin Version; ArchiveName: GENERIC; VHDLIB_SIM: GENERIC_LIB; Published: 29-Jan-2004; Publisher: Altium Limited; LastRevisionNo: 1.00.00; HelpURL: CR0118 FPGA Generic Library Guide.pdf#page=383; ComponentLink1URL: CR0137 FPGA Multiplexer Resource Usage.pdf#page=58; ComponentLink1Description: Core &Resource Usage; FunctionalClass: Multiplexer
U?#31 = COMP2S: 2-Bit Identity Comparator, Single Pin Version; XilinxEquivalent: COMP2; SubClass: COMP; PortSize: 2; ArchiveName: GENERIC; VHDLIB_SIM: GENERIC_LIB; Published: 29-Jan-2004; Publisher: Altium Limited; LastRevisionNo: 1.00.00; HelpURL: CR0118 FPGA Generic Library Guide.pdf#page=151; ComponentLink1URL: CR0129 FPGA Comparator Resource Usage.pdf#page=3; ComponentLink1Description: Core &Resource Usage; FunctionalClass: Comparator; PortStyle: Single Pin Version
U?#33 U?#34 = PULLDOWN: Level Low; FunctionalClass: Wired Function; ArchiveName: GENERIC; VHDLIB_SIM: GENERIC_LIB; Published: 29-Jan-2004; Publisher: Altium Limited; XilinxEquivalent: PULLDOWN; LastRevisionNo: 1.00.00; HelpURL: CR0118 FPGA Generic Library Guide.pdf#page=414; ComponentLink1URL: CR0143 FPGA Wired Function Resource Usage.pdf#page=2; ComponentLink1Description: Core &Resource Usage; SubClass: Pulldown
U?#35 = M1_S1S8E: 1x1-Single Wire to 8x1-Single Wire Multiplexer (Demultiplex) With Enable; SubClass: S1Sn; Enable: High; PortSize: 1; PortStyle: Single Pin Version; ArchiveName: GENERIC; VHDLIB_SIM: GENERIC_LIB; Published: 29-Jan-2004; Publisher: Altium Limited; LastRevisionNo: 1.00.00; HelpURL: CR0118 FPGA Generic Library Guide.pdf#page=350; ComponentLink1URL: CR0137 FPGA Multiplexer Resource Usage.pdf#page=44; ComponentLink1Description: Core &Resource Usage; FunctionalClass: Multiplexer
U?#38 = INV: Inverter; FunctionalClass: Logic Primitive; ArchiveName: GENERIC; VHDLIB_SIM: GENERIC_LIB; Published: 29-Jan-2004; Publisher: Altium Limited; XilinxEquivalent: INV; LastRevisionNo: 1.00.00; HelpURL: CR0118 FPGA Generic Library Guide.pdf#page=291; ComponentLink1URL: CR0136 FPGA Logic Primitive Resource Usage.pdf#page=61; ComponentLink1Description: Core &Resource Usage; SubClass: INV